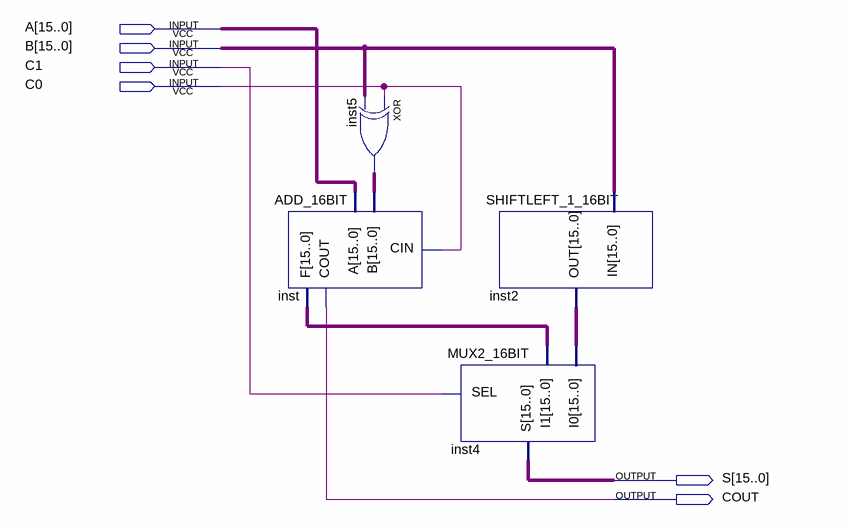
[diagram p0: schematic sheet]
// Quartus schematic ADD_SHIFTLEFT.bdf as structural Verilog: 4 symbols, 6 pins
module ADD_SHIFTLEFT (
  input  [15:0] A,
  input  [15:0] B,
  input  C1,
  input  C0,
  output [15:0] S,
  output COUT
);

  wire [15:0] inst2_out, inst5_out, inst_f;

  ADD_16BIT inst (.CIN(C0), .A(A), .B(inst5_out), .F(inst_f), .COUT(COUT));
  assign inst5_out = {16{C0}} ^ B;  // XOR inst5, 16 bits wide
  MUX2_16BIT inst4 (.I1(inst_f), .I0(inst2_out), .SEL(C1), .S(S));
  SHIFTLEFT_1_16BIT inst2 (.IN(B), .OUT(inst2_out));
endmodule
